# EasyEDA Pro project PCB源文件-电控箱转接板NC4040-4.0-1.0.eprj

# Schematic 原理图
Board Name: 电控箱转接; Create Date: 2024-04-22; Page Name: 主控MCU; Project Name: 转接板03; Schematic Name: 原理图; Update Date: 2025-07-30; Company: 嘉立创EDA; Page Size: A3; Version: V1.0
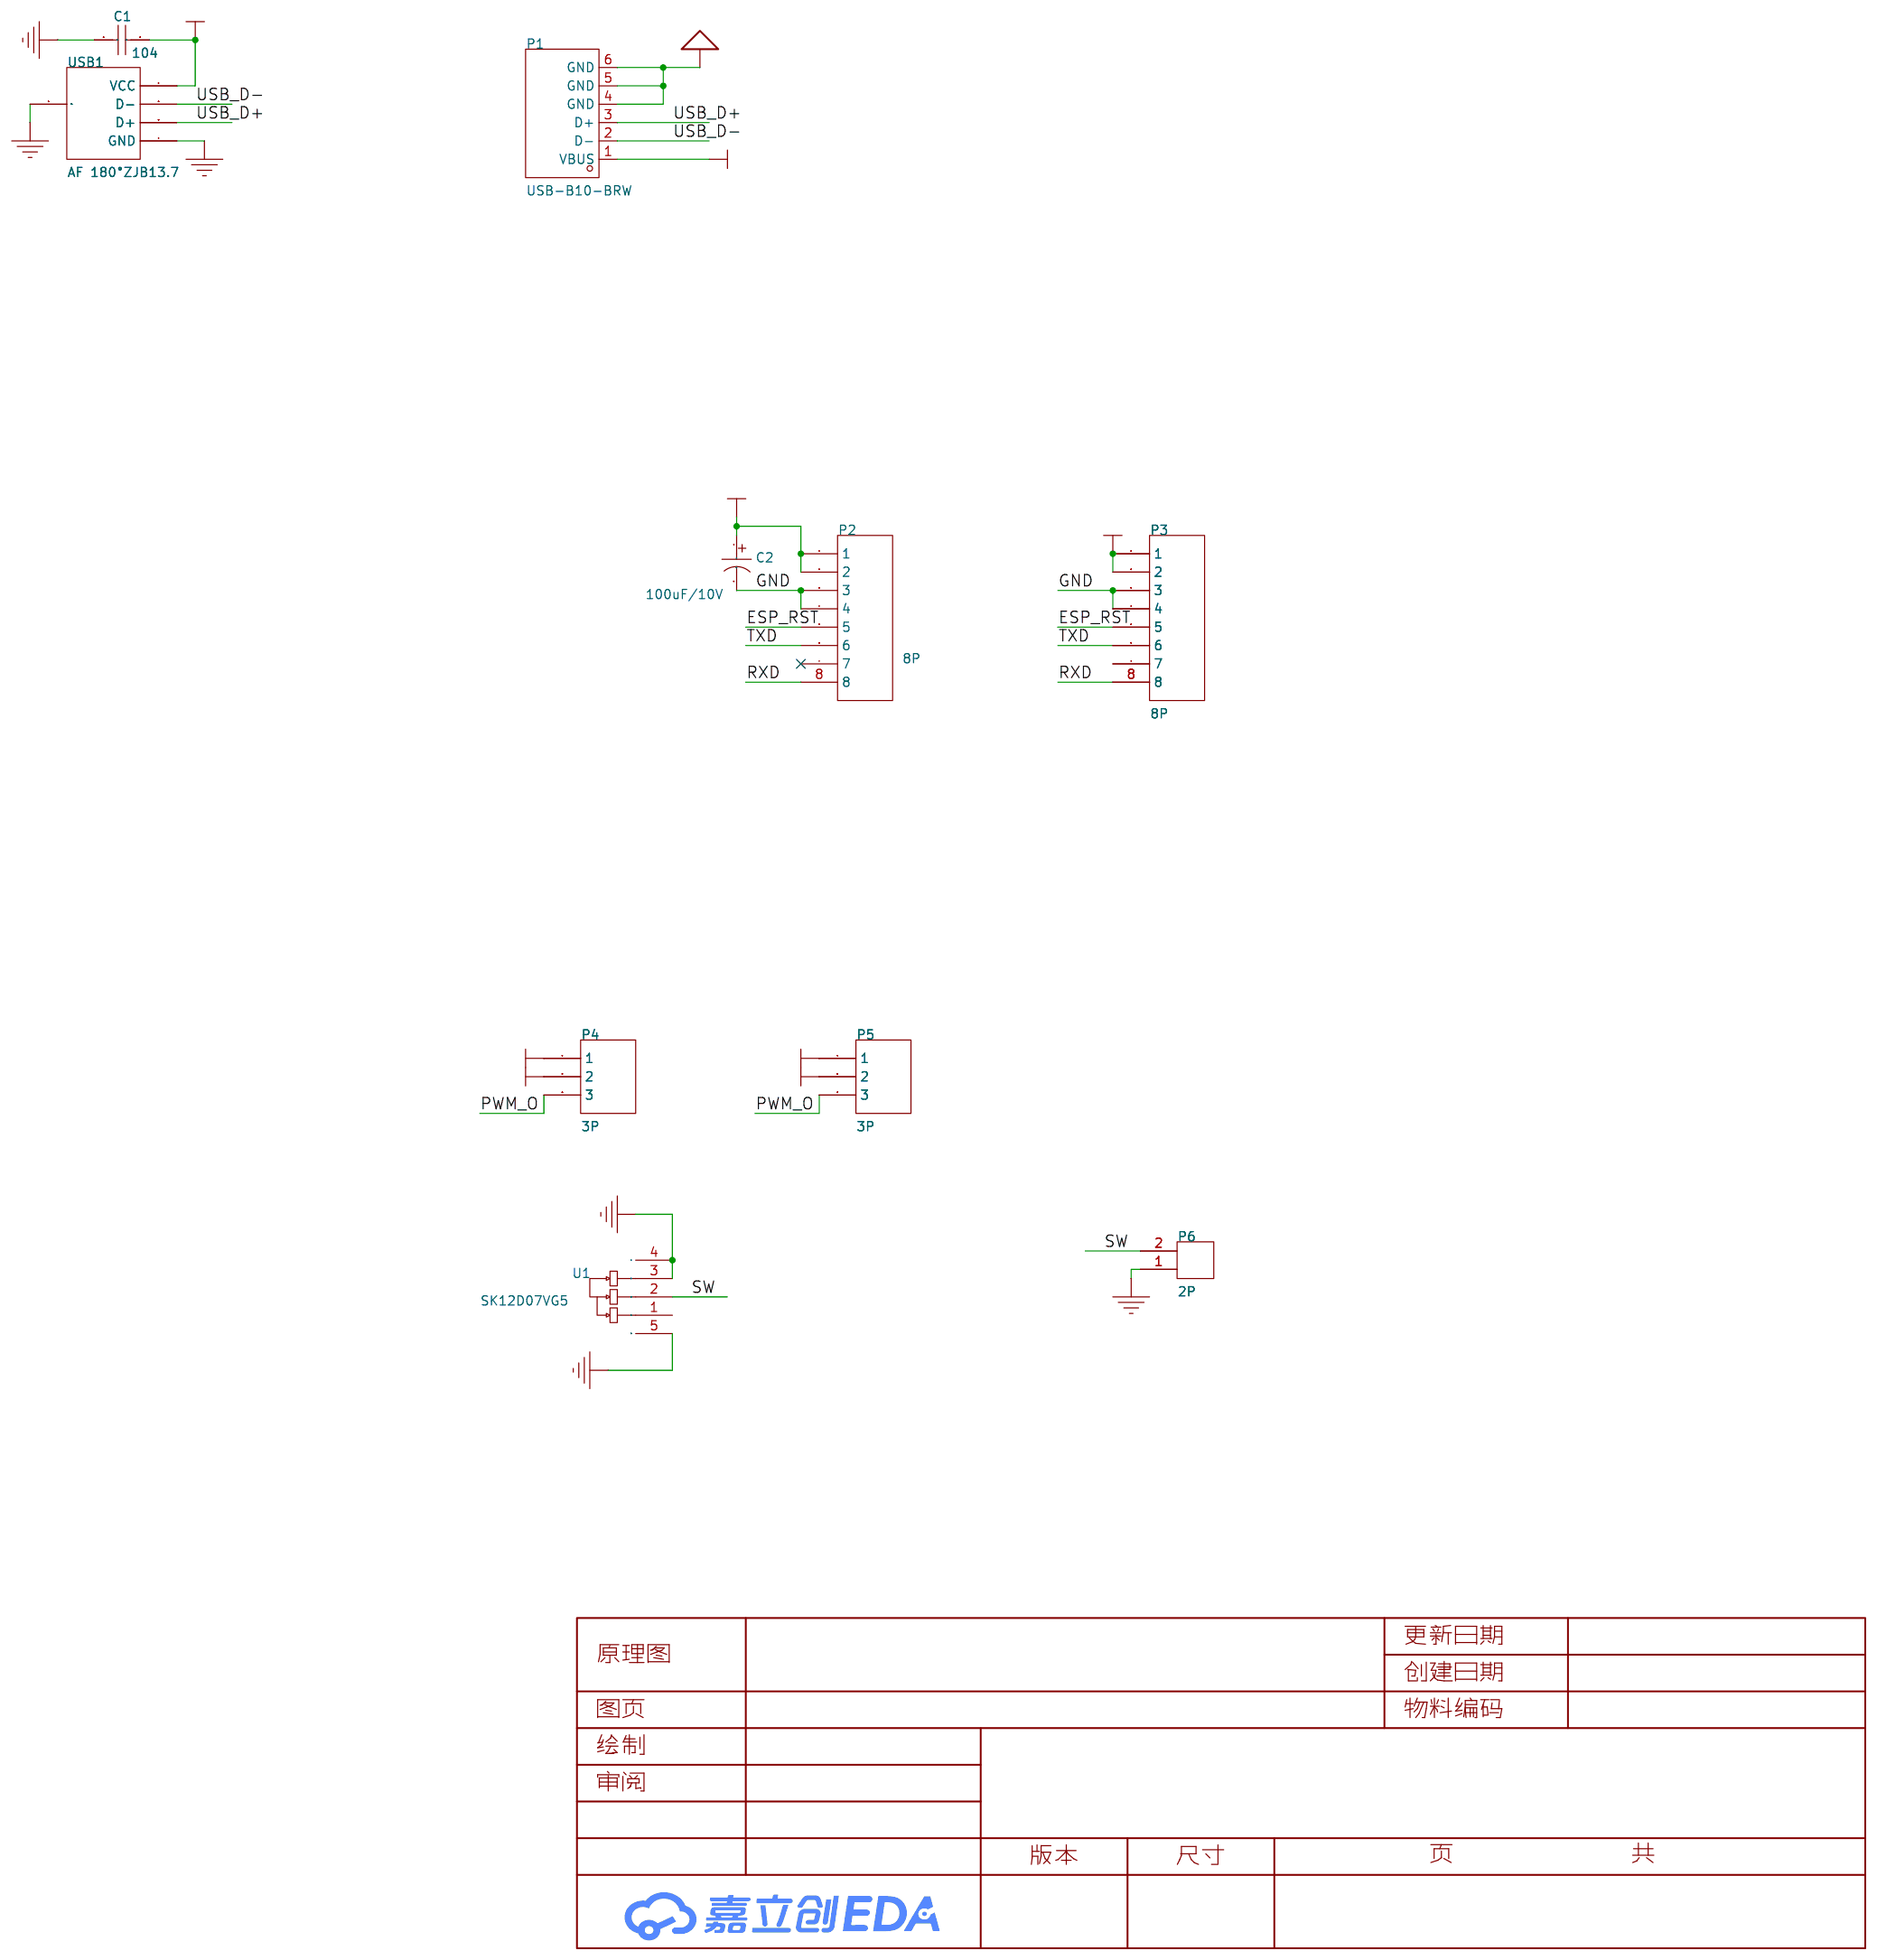
[diagram p0: schematic sheet]

## Parts
C1  104  [0603C]
C2  100uF/10V  [CAP-SMD_BD5.0-L5.3-W5.3-RD]
P1  USB-B10-BRW  [USB-B-TH_USB-B10-BRW]
P2  8P  [IDC8]
P3  8P  [IDC8弯脚]
P4  3P  [HDR1X3_CON]
P5  3P  [HDR1X3_P]
P6  2P  [HDR1X2_CON]
U1  SK12D07VG5  [SW-TH_SHOU_SK12D07VG5]
USB1  AF 180°ZJB13.7  [USB-A-TH_AF-ZJB13.7]

## Library data of the parts
C1 = 104: Capacitor (Semiconductor SIM Model); Published: 8-Jun-2000; LatestRevisionDate: 17-Jul-2002; LatestRevisionNote: Re-released for DXP Platform.; PackageReference: C1206; Publisher: Altium Limited; Origin Footprint 2: C1206; Origin Footprint 3: 0402; Origin Footprint 4: 1310[0504]; Origin Footprint 5: 1608[0603]; Origin Footprint 6: C1210; Origin Footprint 7: C0805; Origin Footprint 8: C1206; Origin Footprint 9: 0805; Origin Footprint 10: 0805L; Design Item ID: Cap Semi; Library Name: Miscellaneous Devices
C2 = CS1A101M-CRD54: 容值:100uF;精度:±20%;额定电压:10V;电容体直径:5mm;电容体长度:5.4mm;纹波电流:-;等效串联电阻:-;工作寿命:1000hrs@105℃;工作温度:-40℃~+105℃;; LCSC Part Name: 100uF ±20% 10V; Supplier Part: C96182; Manufacturer: ST(先科); Supplier Footprint: SMD,5x5.4mm; JLCPCB Part Class: Extended Part; Datasheet: https://atta.szlcsc.com/upload/public/pdf/source/20170304/1488621207726.pdf; Supplier: LCSC; Tolerance: ±20%; Rated Voltage: 10V; φD: 5mm; L: 5.4mm; Lifetime @ Temp: 1000hrs@105℃; Operating Temperature: -40℃~+105℃
P1 = USB-B10-BRW: 连接器类型:Type-B;标准:USB 2.0;公母:母;端口数量:1;触点数量:4P;安装方式:弯插;额定电流 - 电源:1.5A;工作温度范围:-20℃~+70℃;焊接温度(最大值):260℃;; LCSC Part Name: Type-B母弯插; Supplier Part: C720549; Manufacturer: XUNPU(讯普); Supplier Footprint: 插件; JLCPCB Part Class: 扩展库; Datasheet: https://atta.szlcsc.com/upload/public/pdf/source/20200812/C720549_53E9294752E2933874870440E626C579.pdf; Supplier: LCSC; Connector Type: Type-B; Standard: USB2.0; Gender: 母; Number of Ports: 1; Number of Contacts: 4P; Mounting Style: 弯插; Current Rating - Power (Max): 1.5A; Operating Temperature Range: -20℃~+70℃; Soldering Temperature(Max): 260℃
P2 P3 = 8P: Library Name: SCH封装库
P4 P5 = 3P: Library Name: SCH封装库
P6 = 2P: Library Name: SCH--װ--
U1 = SK12D07VG5_C3020419: Supplier Part: C3020419; Manufacturer: SHOU HAN(首韩); Supplier Footprint: 插件; JLCPCB Part Class: 扩展库; Datasheet: https://atta.szlcsc.com/upload/public/pdf/source/20190925/C431548_D6571AEBDE139FDB1E6F8A4B1513A630.pdf; Supplier: LCSC; Circuit: 单刀双掷; Termination Style: PC引脚; Length: 8.7mm; Width: 4.4mm; Switch Height: 4.7mm; Current Rating: 500mA; Voltage Rating: 50V; Life: 5千次; Operating Temperature: -10℃~+50℃
USB1 = AF 180°ZJB13.7: LCSC Part Name: Type-A 母 直插; Supplier Part: C456015; Manufacturer: SHOU HAN(首韩); Supplier Footprint: 插件; JLCPCB Part Class: 扩展库; Datasheet: https://atta.szlcsc.com/upload/public/pdf/source/20241125/3F1287FBF237B0DC4F79F9BB9BA7EB30.pdf; Supplier: LCSC; Connector Type: Type-A; Standard: USB 2.0; Gender: 母; Mounting Style: 直插; Number of Contacts: 4P; Number of Ports: 1; Current Rating - Power (Max): 1.5A; Rated Voltage (Max): 30V; Connect-Disconnect Life: 5千次; Length: 13.7mm; Core Colour: 白色; Operating Temperature Range: -25℃~+85℃

## Nets
5V_VCC: C2.1 P2.1 P2.2 P3.1 P3.2
24V: P4.1 P5.1
GND: C1.2 C2.2 P1.4(GND) P1.5(GND) P1.6(GND) P2.3 P2.4 P3.3 P3.4 P4.2 P5.2 P6.1 U1.3 U1.4 U1.5 USB1.4(GND) USB1.5(SHLD)
ESP_RST: P2.5 P3.5
PWM_O: P4.3 P5.3
RXD: P2.8 P3.8
SW: P6.2 U1.2
TXD: P2.6 P3.6
USB_D+: P1.3(D+) USB1.3(D+)
USB_D-: P1.2(D-) USB1.2(D-)
VUSB: C1.1 P1.1(VBUS) USB1.1(VCC)

Not connected (* = marked no-connect by the designer): P2 7*; P3 7; U1 1

# Board PCB
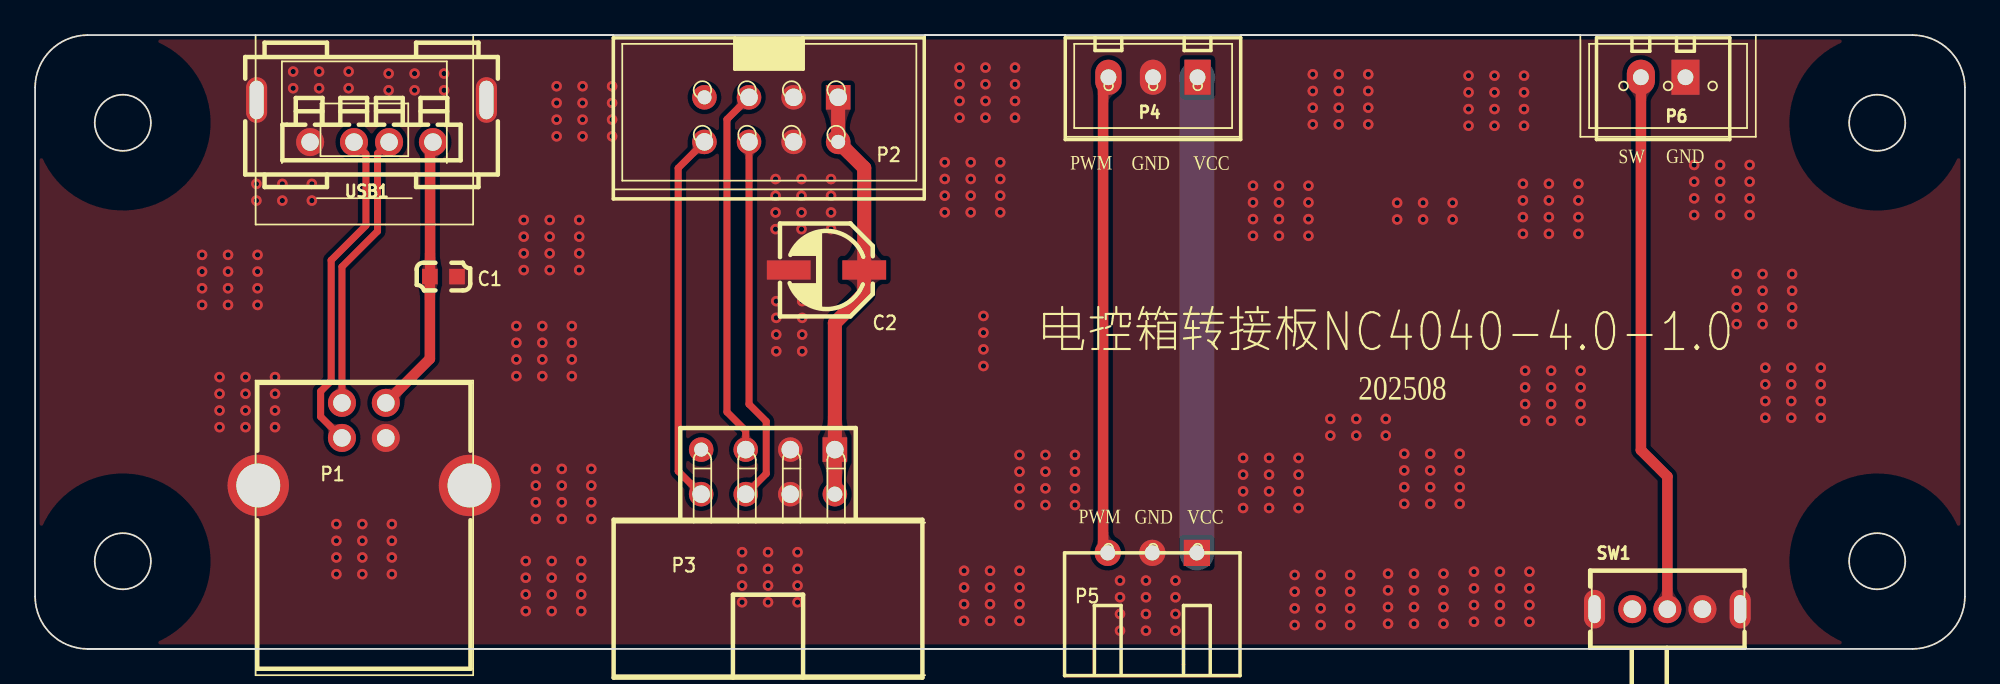
[diagram p1: board, top side]
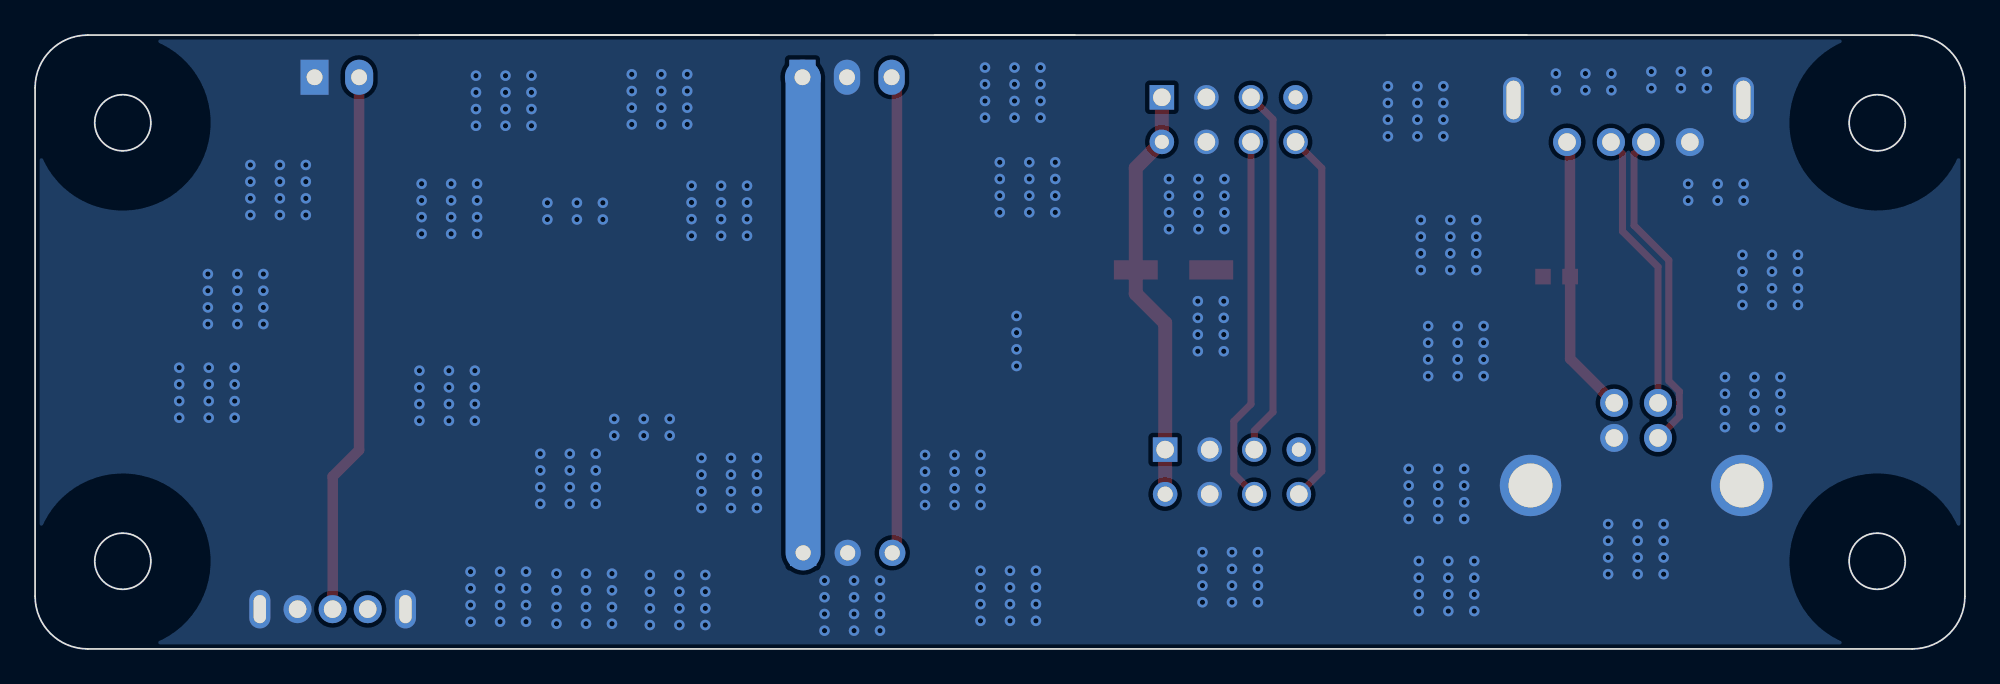
[diagram p2: board, bottom side, seen from below]

Outline 110 x 35 mm; copper layers: Top Layer, Bottom Layer. Coordinates in mm from the lower left corner of the outline.
Outline path: circle c5,30 r1.6 ; circle c5,5 r1.6 ; circle c105,5 r1.6 ; circle c105,30 r1.6 ; 32.97,35 3,35 arc(0.88,34.12) 0,32 0,3 arc(0.88,0.88) 3,0 107,0 arc(109.12,0.88) 110,3 110,32 arc(109.12,34.12) 107,35 68.73,35 ; 58.73,35 24.97,35 ; 88.08,35 50.73,35
Stack: Top Layer 0.035mm / Dielectric1 1.51mm FR4 er 4.5 / Bottom Layer 0.035mm

## Design rules (mm)
template: 用户自定义配置
spacing Default (default): track to track 0.152, other pairs 0 to 0.152
track width Default (default): min 0.254, default 0.254, max 25.4
differential pair differentialPair (default): width min 0.127, default 0.254, max 2.54; gap min 0.152, default 0.152
via Default (default): diameter min 0.25, default 0.61, max 100.025; hole min 0.2, default 0.305, max 59.995

## Placement (name value [footprint] x y rotation side)
C1  104  [0603C]  23.28 21.23 0 top
C2  100uF/10V  [CAP-SMD_BD5.0-L5.3-W5.3-RD]  45.11 21.61 0 top
P1  USB-B10-BRW  [USB-B-TH_USB-B10-BRW]  18.74 11.67 0 top
P2  8P  [IDC8]  41.96 30.43 180 top
P3  8P  [IDC8弯脚]  41.78 10.09 180 top
P4  3P  [HDR1X3_CON]  63.72 32.59 180 top
P5  3P  [HDR1X3_P]  63.68 5.48 0 top
P6  2P  [HDR1X2_CON]  92.8 32.59 180 top
SW1  SK12D07VG5  [SW-TH_SHOU_SK12D07VG5]  93.04 2.27 0 top
USB1  AF 180°ZJB13.7  [USB-A-TH_AF-ZJB13.7]  19.18 30.1 180 top

## Footprints (pads in the part's own frame, mm; a bottom-side part is the same pattern mirrored in y, then rotated)
0603C
  rect 0.889x0.889 smd: 1(-0.774,0) 2(0.774,0)
CAP-SMD_BD5.0-L5.3-W5.3-RD
  rect 2.5x1.1 smd: 1(2.15,0) 2(-2.15,0)
HDR1X2_CON
  rect 1.6x2 hole 0.9: 1(-1.27,0)
  oval 1.6x2 hole 0.9: 2(1.27,0)
HDR1X3_CON
  rect 1.5x2 hole 0.9: 1(-2.54,0)
  oval 1.5x2 hole 0.9: 2(0,0) 3(2.54,0)
HDR1X3_P
  rect 1.5x1.5 hole 0.86: 1(2.54,0)
  round 1.5 hole 0.86: 2(0,0) 3(-2.54,0)
IDC8
  rect 1.4x1.4 hole 1: 1(-3.812,-1.019)
  round 1.4 hole 0.8: 2(-3.812,1.521) 7(3.808,-1.019)
  round 1.4 hole 1: 3(-1.272,-1.019) 4(-1.272,1.521) 5(1.268,-1.019) 6(1.268,1.521) 8(3.808,1.521)
IDC8弯脚
  rect 1.4x1.4 hole 1: 1(-3.81,-1.27)
  round 1.4 hole 0.86: 2(-3.81,1.27)
  round 1.4 hole 1: 3(-1.27,-1.27) 4(-1.27,1.27) 5(1.27,-1.27) 6(1.27,1.27) 8(3.81,1.27)
  round 1.4 hole 0.8: 7(3.81,-1.27)
SW-TH_SHOU_SK12D07VG5
  oval 1.6x1.6 hole 1: 1(-2,0) 2(0,0) 3(2,0)
  oval 1.2x2.2 hole 0.7x1.6: 4(4.15,0) 5(-4.15,0)
USB-A-TH_AF-ZJB13.7
  round 1.6 hole 1: 1(-3.5,1.2) 2(-1,1.2) 3(1,1.2) 4(3.5,1.2)
  oval 1.2x2.6 hole 0.8x2.2: 5(-6.55,-1.2) 5(6.55,-1.2)
USB-B-TH_USB-B10-BRW
  round 1.6 hole 1: 1(1.25,2.355) 2(-1.25,2.355) 3(-1.25,0.355) 4(1.25,0.355)
  round 3.5 hole 2.5: 5(-6.02,-2.355) 6(6.02,-2.355)

## Nets
As in the schematic, except:
GND: C1.2 C2.2 P1.4 P1.5 P1.6 P2.3 P2.4 P3.3 P3.4 P4.2 P5.2 P6.1 SW1.3 SW1.4 SW1.5 USB1.4 USB1.5
SW: P6.2 SW1.2

Pads without a net: P2 7; P3 7; SW1 1

## Via types
v1: diameter 0.6, hole 0.3, Top Layer to Bottom Layer, 378 vias

## Routing (per net, layer and track width the routed paths; a pad name or vN(x,y) marks a point on that pad's centre or on a via; arc(x,y) is an arc through that point)
5V_VCC: length 23.9
  Top Layer w0.8: P2.1 P2.2 47.26,27.43 C2.1 47.26,20.26 45.59,18.58 P3.1 P3.2
24V: length 27.1
  Bottom Layer w2: P4.1 66.22,32.56 P5.1
GND:
  vias: v1(9.52,22.47) v1(9.52,21.52) v1(9.52,20.56) v1(9.52,19.61) v1(10.51,15.5) v1(10.51,14.55) v1(10.51,13.6) v1(10.51,12.64) v1(11,22.47) v1(11,21.52) v1(11,20.56) v1(11,19.61) v1(11.99,15.5) v1(11.99,14.55) v1(11.99,13.6) v1(11.99,12.64) v1(12.61,26.52) v1(12.61,25.56) v1(12.68,22.47) v1(12.68,21.52) v1(12.68,20.56) v1(12.68,19.61) v1(13.68,15.5) v1(13.68,14.55) v1(13.68,13.6) v1(13.68,12.64) v1(14.09,26.52) v1(14.09,25.56) v1(14.71,32.92) v1(14.71,31.97) v1(15.78,26.52) v1(15.78,25.56) v1(16.19,32.92) v1(16.19,31.97) v1(17.17,7.12) v1(17.17,6.17) v1(17.17,5.21) v1(17.17,4.26) v1(17.87,32.92) v1(17.87,31.97) v1(18.65,7.12) v1(18.65,6.17) v1(18.65,5.21) v1(18.65,4.26) v1(20.15,32.81) v1(20.15,31.85) v1(20.34,7.12) v1(20.34,6.17) v1(20.34,5.21) v1(20.34,4.26) v1(21.63,32.81) v1(21.63,31.85) v1(23.31,32.81) v1(23.31,31.85) v1(27.43,18.41) v1(27.43,17.46) v1(27.43,16.51) v1(27.43,15.55) v1(27.85,24.46) v1(27.85,23.5) v1(27.85,22.55) v1(27.85,21.6) v1(27.97,5.01) v1(27.97,4.06) v1(27.97,3.11) v1(27.97,2.16) v1(28.54,10.27) v1(28.54,9.31) v1(28.54,8.36) v1(28.54,7.41) v1(28.91,18.41) v1(28.91,17.46) v1(28.91,16.51) v1(28.91,15.55) v1(29.33,24.46) v1(29.33,23.5) v1(29.33,22.55) v1(29.33,21.6) v1(29.45,5.01) v1(29.45,4.06) v1(29.45,3.11) v1(29.45,2.16) v1(29.73,32.08) v1(29.73,31.13) v1(29.73,30.18) v1(29.73,29.23) v1(30.02,10.27) v1(30.02,9.31) v1(30.02,8.36) v1(30.02,7.41) v1(30.59,18.41) v1(30.59,17.46) v1(30.59,16.51) v1(30.59,15.55) v1(31.02,24.46) v1(31.02,23.5) v1(31.02,22.55) v1(31.02,21.6) v1(31.13,5.01) v1(31.13,4.06) v1(31.13,3.11) v1(31.13,2.16) v1(31.21,32.08) v1(31.21,31.13) v1(31.21,30.18) v1(31.21,29.23) v1(31.7,10.27) v1(31.7,9.31) v1(31.7,8.36) v1(31.7,7.41) v1(32.89,32.08) v1(32.89,31.13) v1(32.89,30.18) v1(32.89,29.23) v1(40.3,5.52) v1(40.3,4.56) v1(40.3,3.61) v1(40.3,2.66) v1(41.78,5.52) v1(41.78,4.56) v1(41.78,3.61) v1(41.78,2.66) v1(42.21,26.79) v1(42.21,25.84) v1(42.21,24.89) v1(42.21,23.93) v1(42.25,19.83) v1(42.25,18.88) v1(42.25,17.92) v1(42.25,16.97) v1(43.46,5.52) v1(43.46,4.56) v1(43.46,3.61) v1(43.46,2.66) v1(43.69,26.79) v1(43.69,25.84) v1(43.69,24.89) v1(43.69,23.93) v1(43.72,19.83) v1(43.72,18.88) v1(43.72,17.92) v1(43.72,16.97) v1(45.37,26.79) v1(45.37,25.84) v1(45.37,24.89) v1(45.37,23.93) v1(51.85,27.75) v1(51.85,26.8) v1(51.85,25.84) v1(51.85,24.89) v1(52.69,33.15) v1(52.69,32.19) v1(52.69,31.24) v1(52.69,30.29) v1(52.95,4.46) v1(52.95,3.51) v1(52.95,2.55) v1(52.95,1.6) v1(53.33,27.75) v1(53.33,26.8) v1(53.33,25.84) v1(53.33,24.89) v1(54.06,18.99) v1(54.06,18.03) v1(54.06,17.08) v1(54.06,16.13) v1(54.17,33.15) v1(54.17,32.19) v1(54.17,31.24) v1(54.17,30.29) v1(54.43,4.46) v1(54.43,3.51) v1(54.43,2.55) v1(54.43,1.6) v1(55.01,27.75) v1(55.01,26.8) v1(55.01,25.84) v1(55.01,24.89) v1(55.86,33.15) v1(55.86,32.19) v1(55.86,31.24) v1(55.86,30.29) v1(56.11,11.06) v1(56.11,10.11) v1(56.11,9.16) v1(56.11,8.2) v1(56.11,4.46) v1(56.11,3.51) v1(56.11,2.55) v1(56.11,1.6) v1(57.59,11.06) v1(57.59,10.11) v1(57.59,9.16) v1(57.59,8.2) v1(59.27,11.06) v1(59.27,10.11) v1(59.27,9.16) v1(59.27,8.2) v1(61.84,3.9) v1(61.84,2.94) v1(61.84,1.99) v1(61.84,1.04) v1(63.32,3.9) v1(63.32,2.94) v1(63.32,1.99) v1(63.32,1.04) v1(65,3.9) v1(65,2.94) v1(65,1.99) v1(65,1.04) v1(68.86,10.89) v1(68.86,9.94) v1(68.86,8.98) v1(68.86,8.03) v1(69.42,26.41) v1(69.42,25.46) v1(69.42,24.51) v1(69.42,23.55) v1(70.34,10.89) v1(70.34,9.94) v1(70.34,8.98) v1(70.34,8.03) v1(70.9,26.41) v1(70.9,25.46) v1(70.9,24.51) v1(70.9,23.55) v1(71.8,4.22) v1(71.8,3.27) v1(71.8,2.31) v1(71.8,1.36) v1(72.02,10.89) v1(72.02,9.94) v1(72.02,8.98) v1(72.02,8.03) v1(72.58,26.41) v1(72.58,25.46) v1(72.58,24.51) v1(72.58,23.55) v1(72.83,32.76) v1(72.83,31.81) v1(72.83,30.86) v1(72.83,29.91) v1(73.27,4.22) v1(73.27,3.27) v1(73.27,2.31) v1(73.27,1.36) v1(73.83,13.11) v1(73.83,12.16) v1(74.31,32.76) v1(74.31,31.81) v1(74.31,30.86) v1(74.31,29.91) v1(74.96,4.22) v1(74.96,3.27) v1(74.96,2.31) v1(74.96,1.36) v1(75.31,13.11) v1(75.31,12.16) v1(75.99,32.76) v1(75.99,31.81) v1(75.99,30.86) v1(75.99,29.91) v1(76.99,13.11) v1(76.99,12.16) v1(77.12,4.29) v1(77.12,3.34) v1(77.12,2.39) v1(77.12,1.44) v1(77.64,25.44) v1(77.64,24.49) v1(78.04,11.13) v1(78.04,10.18) v1(78.04,9.22) v1(78.04,8.27) v1(78.6,4.29) v1(78.6,3.34) v1(78.6,2.39) v1(78.6,1.44) v1(79.12,25.44) v1(79.12,24.49) v1(79.52,11.13) v1(79.52,10.18) v1(79.52,9.22) v1(79.52,8.27) v1(80.28,4.29) v1(80.28,3.34) v1(80.28,2.39) v1(80.28,1.44) v1(80.8,25.44) v1(80.8,24.49) v1(81.2,11.13) v1(81.2,10.18) v1(81.2,9.22) v1(81.2,8.27) v1(81.71,32.69) v1(81.71,31.73) v1(81.71,30.78) v1(81.71,29.83) v1(82.02,4.41) v1(82.02,3.45) v1(82.02,2.5) v1(82.02,1.55) v1(83.19,32.69) v1(83.19,31.73) v1(83.19,30.78) v1(83.19,29.83) v1(83.49,4.41) v1(83.49,3.45) v1(83.49,2.5) v1(83.49,1.55) v1(84.87,32.69) v1(84.87,31.73) v1(84.87,30.78) v1(84.87,29.83) v1(84.81,26.52) v1(84.81,25.57) v1(84.81,24.62) v1(84.81,23.67) v1(84.93,15.87) v1(84.93,14.91) v1(84.93,13.96) v1(84.93,13.01) v1(85.18,4.41) v1(85.18,3.45) v1(85.18,2.5) v1(85.18,1.55) v1(86.29,26.52) v1(86.29,25.57) v1(86.29,24.62) v1(86.29,23.67) v1(86.41,15.87) v1(86.41,14.91) v1(86.41,13.96) v1(86.41,13.01) v1(87.97,26.52) v1(87.97,25.57) v1(87.97,24.62) v1(87.97,23.67) v1(88.09,15.87) v1(88.09,14.91) v1(88.09,13.96) v1(88.09,13.01) v1(94.57,27.59) v1(94.57,26.64) v1(94.57,25.69) v1(94.57,24.74) v1(96.05,27.59) v1(96.05,26.64) v1(96.05,25.69) v1(96.05,24.74) v1(96.99,21.38) v1(96.99,20.42) v1(96.99,19.47) v1(96.99,18.52) v1(97.73,27.59) v1(97.73,26.64) v1(97.73,25.69) v1(97.73,24.74) v1(98.47,21.38) v1(98.47,20.42) v1(98.47,19.47) v1(98.47,18.52) v1(98.62,16.04) v1(98.62,15.08) v1(98.62,14.13) v1(98.62,13.18) v1(100.15,21.38) v1(100.15,20.42) v1(100.15,19.47) v1(100.15,18.52) v1(100.1,16.04) v1(100.1,15.08) v1(100.1,14.13) v1(100.1,13.18) v1(101.78,16.04) v1(101.78,15.08) v1(101.78,14.13) v1(101.78,13.18)
ESP_RST: length 21.1
  Top Layer w0.4: P2.5 39.44,30.19 39.44,13.51 40.51,12.44 P3.5
PWM_O: length 27.4
  Top Layer w0.6: P4.3 60.88,32.29 60.88,5.74 P5.3
RXD: length 21.3
  Top Layer w0.4: P2.8 36.66,27.41 36.66,10.13 P3.8
SW: length 31
  Top Layer w0.6: P6.2 91.53,32.59 91.53,11.34 93.04,9.83 SW1.2
TXD: length 21
  Top Layer w0.4: P3.6 41.67,9.99 41.67,12.97 40.69,13.95 P2.6
USB_D+: length 18.7
  Top Layer w0.4: P1.3 16.28,13.25 16.28,14.68 16.88,15.28 16.88,22.16 18.86,24.14 18.86,28.22 USB1.3
USB_D-: length 16
  Top Layer w0.4: USB1.2 19.52,28.24 19.52,23.81 17.49,21.79 P1.2
VUSB: length 16
  Top Layer w0.6: P1.1 22.5,16.54 C1.1 22.51,21.24 22.51,28.74 USB1.1

## Copper pours and planes (outline as drawn; the poured copper is in the pictures)
GND on Top Layer: -1.66,37 111.5,37 111.5,-2.4 -1.66,-2.4
GND on Bottom Layer: -2.18,37.12 112.02,37.12 112.02,-2.02 -2.18,-2.02

Small or netless copper shapes (teardrops, artwork), in the pictures only: 26 on Top Layer

## Text on the board
Top Silkscreen Layer: PWM | GND | SW | VCC | 202508 | 电控箱转接板NC4040-4.0-1.0
